# Altium schematic sheet SWD.SchDoc
size A; SheetNumber: 7; SheetTotal: 8
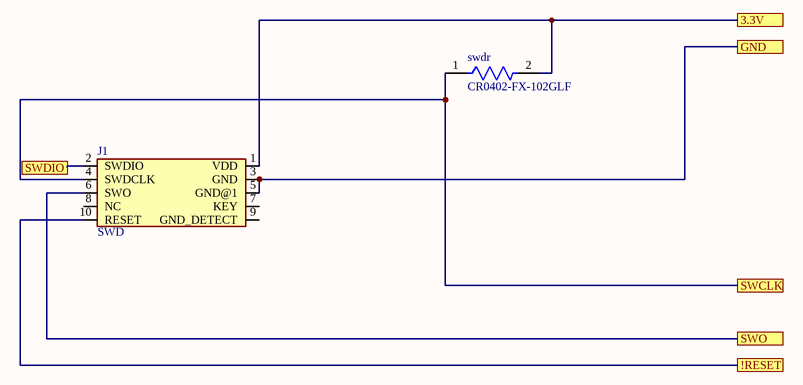
[diagram p0: SWD.SchDoc]

## Parts
J1  SWD  [2X10_BOXHEADER]
swdr  CR0402-FX-102GLF  [FP-CR0402-IPC_C]

## Ports
3.3V, !RESET, GND, SWCLK, SWDIO, SWO

## Nets
3.3V: J1.1(VDD) swdr.2 ; port 3.3V
!RESET: J1.10(RESET) ; port !RESET
GND: J1.3(GND) J1.5(GND@1) ; port GND
SWCLK: J1.4(SWDCLK) swdr.1 ; port SWCLK
SWDIO: J1.2(SWDIO) ; port SWDIO
SWO: J1.6(SWO) ; port SWO

Not connected (* = marked no-connect by the designer): J1 7(KEY) 8(NC) 9(GND_DETECT)

## Library data of the parts
J1 = SWD: SWD WRITEON W/DISP .75X1.4 LAB; MF: 3M; Price: None; Value: *; Package: None; SnapEDA_Link: https://www.snapeda.com/parts/SWD/3M%20%28TC%29/view-part/172681/?ref=snap; MP: SWD; Availability: Unavailable
swdr = CMP-2002-04703-2: Thick Film Chip Resistors 0402 1kΩ 0.0625W 1% 100ppm/°C; Voltage Rating: 50V; Max Power Dissipation: 63mW; Resistance: 1kR; Power Rating: 62.5mW; Package Quantity: 10000; Radiation Hardening: No; Temperature Coefficient: 100ppm/°C; Number of Terminations: 2; Packaging: Tape and Reel; Thickness: 356um; Case Code (Metric): 1005; Case/Package: 0402; Case Code (Imperial): 0402; Max Operating Temperature: 155°C; Composition: Thick Film; Min Operating Temperature: -55°C; Mount: Surface Mount; Tolerance: 1%; Termination: SMD/SMT; Width: 0.02inch; Contact Plating: Tin; Height: 0.016inch; Length: 0.039inch